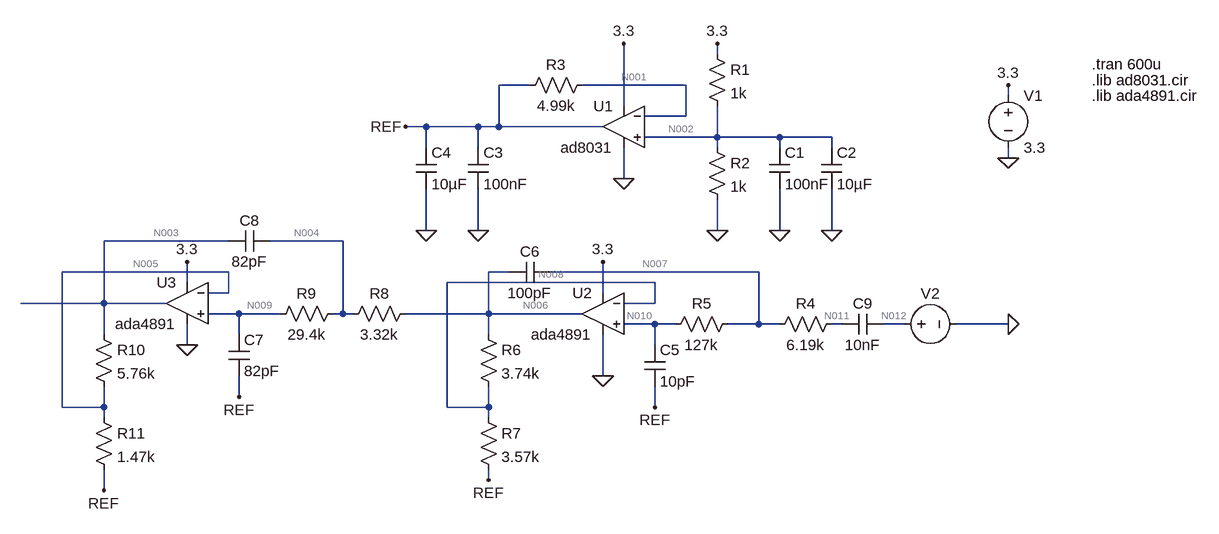
[diagram p0: schematic schematic_lite.asc]
schematic_lite.asc, the LTspice schematic file:
Version 4
SHEET 1 1128 792
WIRE 368 32 368 16
WIRE 80 80 32 80
WIRE 320 80 160 80
WIRE 816 96 816 80
WIRE 224 112 224 16
WIRE 320 128 320 80
WIRE 320 128 256 128
WIRE -80 144 -112 144
WIRE 0 144 -80 144
WIRE 32 144 32 80
WIRE 32 144 0 144
WIRE 192 144 32 144
WIRE 368 160 368 112
WIRE 368 160 256 160
WIRE 464 160 368 160
WIRE 544 160 464 160
WIRE -80 176 -80 144
WIRE 0 176 0 144
WIRE 368 176 368 160
WIRE 464 176 464 160
WIRE 544 176 544 160
WIRE 816 192 816 176
WIRE 224 224 224 176
WIRE -80 304 -80 240
WIRE 0 304 0 240
WIRE 368 304 368 256
WIRE 464 304 464 240
WIRE 544 304 544 240
WIRE -384 320 -576 320
WIRE -208 320 -320 320
WIRE -384 368 -640 368
WIRE 48 368 16 368
WIRE 432 368 112 368
WIRE -448 384 -448 352
WIRE 272 384 -48 384
WIRE -384 400 -384 368
WIRE -384 400 -416 400
WIRE 192 400 192 352
WIRE -576 416 -576 320
WIRE -576 416 -704 416
WIRE -480 416 -576 416
WIRE 272 416 272 384
WIRE 272 416 224 416
WIRE -368 432 -416 432
WIRE -304 432 -368 432
WIRE -208 432 -208 320
WIRE -208 432 -224 432
WIRE -192 432 -208 432
WIRE 16 432 16 368
WIRE 16 432 -112 432
WIRE 160 432 16 432
WIRE 272 448 224 448
WIRE 304 448 272 448
WIRE 432 448 432 368
WIRE 432 448 384 448
WIRE 464 448 432 448
WIRE 560 448 544 448
WIRE 656 448 624 448
WIRE 816 448 736 448
WIRE -576 464 -576 416
WIRE -368 464 -368 432
WIRE 16 464 16 432
WIRE -448 480 -448 448
WIRE 272 480 272 448
WIRE 192 528 192 464
WIRE -368 560 -368 528
WIRE -640 576 -640 368
WIRE -576 576 -576 544
WIRE -576 576 -640 576
WIRE -48 576 -48 384
WIRE 16 576 16 544
WIRE 16 576 -48 576
WIRE 272 576 272 544
WIRE -576 592 -576 576
WIRE 16 592 16 576
WIRE 16 688 16 672
WIRE -576 704 -576 672
FLAG 816 192 0
FLAG 816 80 3.3
FLAG 224 224 0
FLAG 224 16 3.3
FLAG 368 304 0
FLAG 368 16 3.3
FLAG 464 304 0
FLAG 544 304 0
FLAG 0 304 0
FLAG -80 304 0
FLAG -112 144 REF
FLAG 192 352 3.3
FLAG 192 528 0
FLAG 816 448 0
FLAG 272 576 REF
FLAG 16 688 REF
FLAG -368 560 REF
FLAG -448 480 0
FLAG -448 352 3.3
FLAG -576 704 REF
SYMBOL Opamps\\opamp2 224 80 M0
SYMATTR InstName U1
SYMATTR Value ad8031
SYMBOL voltage 816 80 R0
WINDOW 123 0 0 Left 0
WINDOW 39 0 0 Left 0
SYMATTR InstName V1
SYMATTR Value 3.3
SYMBOL res 352 16 R0
SYMATTR InstName R1
SYMATTR Value 1k
SYMBOL res 352 160 R0
SYMATTR InstName R2
SYMATTR Value 1k
SYMBOL cap 448 176 R0
SYMATTR InstName C1
SYMATTR Value 100nF
SYMBOL cap 528 176 R0
SYMATTR InstName C2
SYMATTR Value 10µF
SYMBOL res 176 64 R90
WINDOW 0 0 56 VBottom 2
WINDOW 3 32 56 VTop 2
SYMATTR InstName R3
SYMATTR Value 4.99k
SYMBOL cap -16 176 R0
SYMATTR InstName C3
SYMATTR Value 100nF
SYMBOL cap -96 176 R0
SYMATTR InstName C4
SYMATTR Value 10µF
SYMBOL Opamps\\opamp2 192 368 M0
SYMATTR InstName U2
SYMATTR Value ada4891
SYMBOL res 560 432 R90
WINDOW 0 0 56 VBottom 2
WINDOW 3 32 56 VTop 2
SYMATTR InstName R4
SYMATTR Value 6.19k
SYMBOL res 400 432 R90
WINDOW 0 0 56 VBottom 2
WINDOW 3 32 56 VTop 2
SYMATTR InstName R5
SYMATTR Value 127k
SYMBOL voltage 640 448 R270
WINDOW 0 32 56 VTop 2
WINDOW 3 4 56 Invisible 2
WINDOW 123 0 0 Left 0
WINDOW 39 0 0 Left 0
SYMATTR InstName V2
SYMATTR Value SINE(0 1.6V 177.5k 0 0 0 20)
SYMBOL cap 256 480 R0
SYMATTR InstName C5
SYMATTR Value 10pF
SYMBOL cap 112 352 R90
WINDOW 0 0 32 VBottom 2
WINDOW 3 32 32 VTop 2
SYMATTR InstName C6
SYMATTR Value 100pF
SYMBOL res 0 448 R0
SYMATTR InstName R6
SYMATTR Value 3.74k
SYMBOL res 0 576 R0
SYMATTR InstName R7
SYMATTR Value 3.57k
SYMBOL res -96 416 R90
WINDOW 0 0 56 VBottom 2
WINDOW 3 32 56 VTop 2
SYMATTR InstName R8
SYMATTR Value 3.32k
SYMBOL res -208 416 R90
WINDOW 0 0 56 VBottom 2
WINDOW 3 32 56 VTop 2
SYMATTR InstName R9
SYMATTR Value 29.4k
SYMBOL cap -384 464 R0
SYMATTR InstName C7
SYMATTR Value 82pF
SYMBOL Opamps\\opamp2 -448 352 M0
SYMATTR InstName U3
SYMATTR Value ada4891
SYMBOL cap -320 304 R90
WINDOW 0 0 32 VBottom 2
WINDOW 3 32 32 VTop 2
SYMATTR InstName C8
SYMATTR Value 82pF
SYMBOL res -592 448 R0
SYMATTR InstName R10
SYMATTR Value 5.76k
SYMBOL res -592 576 R0
SYMATTR InstName R11
SYMATTR Value 1.47k
SYMBOL cap 624 432 R90
WINDOW 0 0 32 VBottom 2
WINDOW 3 32 32 VTop 2
SYMATTR InstName C9
SYMATTR Value 10nF
TEXT 944 72 Left 2 !.lib ad8031.cir
TEXT 944 48 Left 2 !.tran 600u
TEXT 944 96 Left 2 !.lib ada4891.cir

The netlist it stands for:
* schematic_lite.asc
XU1 N002 N001 3.3 0 REF ad8031  ; pins In+ In- V+ V- OUT
V1 3.3 0 3.3
R1 3.3 N002 1k
R2 N002 0 1k
C1 N002 0 100nF
C2 N002 0 10µF
R3 N001 REF 4.99k
C3 REF 0 100nF
C4 REF 0 10µF
XU2 N010 N008 3.3 0 N006 ada4891  ; pins In+ In- V+ V- OUT
R4 N011 N007 6.19k
R5 N007 N010 127k
V2 N012 0 SINE(0 1.6V 177.5k 0 0 0 20)
C5 N010 REF 10pF
C6 N007 N006 100pF
R6 N006 N008 3.74k
R7 N008 REF 3.57k
R8 N006 N004 3.32k
R9 N004 N009 29.4k
C7 N009 REF 82pF
XU3 N009 N005 3.3 0 N003 ada4891  ; pins In+ In- V+ V- OUT
C8 N004 N003 82pF
R10 N003 N005 5.76k
R11 N005 REF 1.47k
C9 N012 N011 10nF
.lib ad8031.cir
.tran 600u
.lib ada4891.cir
.backanno
.end

* Results of the author's LTspice run, read from the files saved beside the schematic
* Operating Point, zero values left out:
*   V(n001) = 1.649 V
*   V(n002) = 1.65 V
*   V(ref) = 1.651 V
*   V(3.3) = 3.3 V
*   V(n010) = 1.662 V
*   V(n008) = 1.659 V
*   V(n006) = 1.668 V
*   V(n011) = 1.662 V
*   V(n007) = 1.662 V
*   V(n004) = 1.668 V
*   V(n009) = 1.668 V
*   V(n005) = 1.665 V
*   V(n003) = 1.722 V
*   I(R11) = 9.837 µA
*   I(R10) = 9.837 µA
*   I(R9) = 1.43 pA
*   I(R8) = 1.43 pA
*   I(R7) = 2.321 µA
*   I(R6) = 2.321 µA
*   I(R3) = -424.6 nA
*   I(R2) = 1.65 mA
*   I(R1) = 1.65 mA
*   I(V1) = -10.9 mA
*   Ix(u1:1) = 475.4 nA
*   Ix(u1:2) = 424.6 nA
*   Ix(u1:99) = 438.3 µA
*   Ix(u1:50) = -461.7 µA
*   Ix(u1:61) = 11.73 µA
*   Ix(u2:102) = 4.402 mA
*   Ix(u2:103) = -4.4 mA
*   Ix(u2:104) = -2.321 µA
*   Ix(u3:100) = 1.776 pA
*   Ix(u3:102) = 4.41 mA
*   Ix(u3:103) = -4.4 mA
*   Ix(u3:104) = -9.837 µA
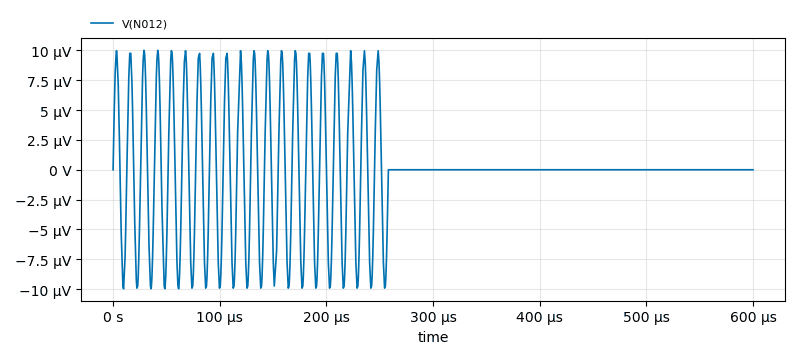
[diagram p1: Transient Analysis of schematic_lite.asc, plotted from the saved traces]
* Transient Analysis, 1 run:
*   V(N012): min -9.966 µV, max 9.995 µV, average -8.547 nV, rms 4.624 µV, last 0 V